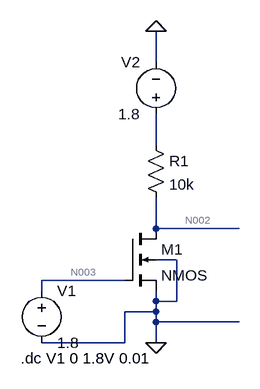
[diagram p0: schematic Voh, Vol.asc]
Voh, Vol.asc, the LTspice schematic file:
Version 4
SHEET 1 880 680
WIRE 176 -128 176 -176
WIRE 176 0 176 -48
WIRE 176 128 176 80
WIRE 304 128 176 128
WIRE 208 176 176 176
WIRE 128 208 0 208
WIRE 0 224 0 208
WIRE 176 240 176 224
WIRE 208 240 208 176
WIRE 208 240 176 240
WIRE 176 256 176 240
WIRE 176 256 128 256
WIRE 176 272 176 256
WIRE 304 272 176 272
WIRE 128 304 128 256
WIRE 128 304 0 304
WIRE 176 304 176 272
FLAG 176 -176 0
FLAG 176 304 0
SYMBOL nmos4 128 128 R0
SYMATTR InstName M1
SYMATTR Value2 l=180n w=4230n
SYMBOL res 160 -16 R0
SYMATTR InstName R1
SYMATTR Value 10k
SYMBOL voltage 176 -32 R180
WINDOW 0 24 96 Left 2
WINDOW 3 24 16 Left 2
WINDOW 123 0 0 Left 0
WINDOW 39 0 0 Left 0
SYMATTR InstName V2
SYMATTR Value 1.8
SYMBOL voltage 0 208 R0
WINDOW 123 0 0 Left 0
WINDOW 39 0 0 Left 0
SYMATTR InstName V1
SYMATTR Value 1.8
TEXT -32 328 Left 2 !.dc V1 0 1.8V 0.01

The netlist it stands for:
* Voh, Vol.asc
M1 N002 N003 0 0 NMOS l=180n w=4230n
R1 N001 N002 10k
V2 N001 0 1.8
V1 N003 0 1.8
.model NMOS NMOS
.model PMOS PMOS
.lib standard.mos
.dc V1 0 1.8V 0.01
.backanno
.end

* Results of the author's LTspice run, read from the files saved beside the schematic
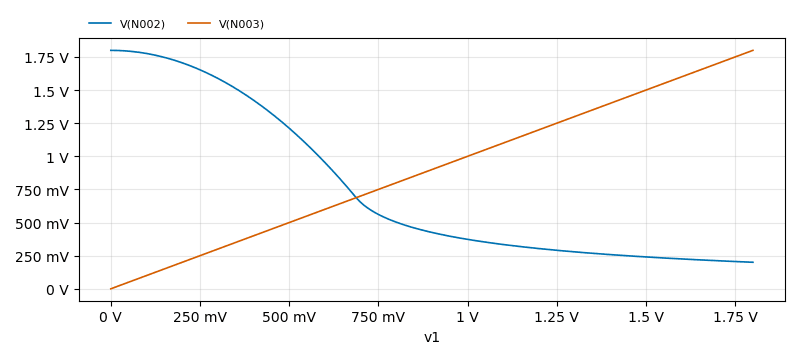
[diagram p1: DC transfer characteristic of Voh, Vol.asc, plotted from the saved traces]
* DC transfer characteristic, 1 run:
*   V(N002): 1.8 V at v1=0 V, 200.2 mV at v1=1.8 V, min 200.2 mV, max 1.8 V
*   V(N003): 0 V at v1=0 V, 1.8 V at v1=1.8 V, min 0 V, max 1.8 V